# EAGLE schematic MCU_V2 (EAGLE 7.6.0)
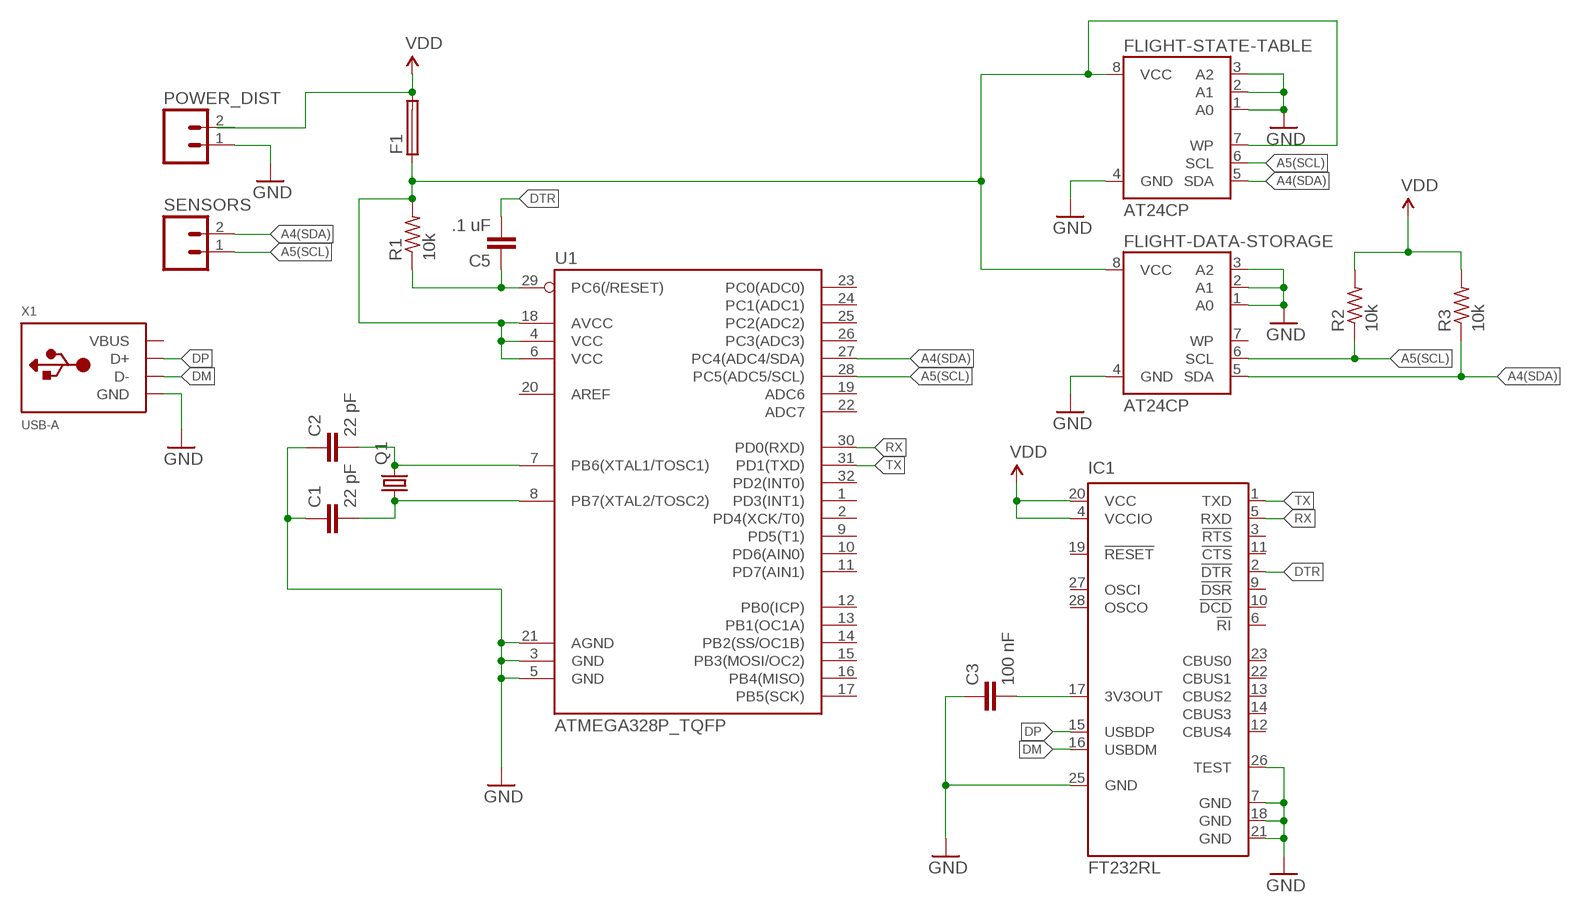
[diagram p0: schematic, sheet 1]

## Parts
C1  22 pF  C2,5-3  [C2.5-3]
C2  22 pF  C2,5-3  [C2.5-3]
C3  100 nF  C2,5-3  [C2.5-3]
C5  .1 uF  C2,5-3  [C2.5-3]
F1  19559  [19559]
FLIGHT-DATA-STORAGE  AT24CP  [DIL08]
FLIGHT-STATE-TABLE  AT24CP  [DIL08]
IC1  FT232RL  [SSOP28]
POWER_DIST  M02PTH  [1X02]
Q1  CRYSTALHC33U-V  [HC33U-V]
R1  10k  R-US_R0805  [R0805]
R2  10k  R-US_R0805  [R0805]
R3  10k  R-US_R0805  [R0805]
SENSORS  M02PTH  [1X02]
U1  ATMEGA328P_TQFP  [TQFP32-08]
X1  USB-A  [MOLEX_480371000]

## Nets
A4(SDA): FLIGHT-DATA-STORAGE.5(SDA) FLIGHT-STATE-TABLE.5(SDA) R3.1 SENSORS.2 U1.27(PC4(ADC4/SDA))
A5(SCL): FLIGHT-DATA-STORAGE.6(SCL) FLIGHT-STATE-TABLE.6(SCL) R2.1 SENSORS.1 U1.28(PC5(ADC5/SCL))
DM: IC1.16(USBDM) X1.2(D-)
DP: IC1.15(USBDP) X1.3(D+)
DTR: C5.2 IC1.2(!DTR)
GND: C1.1 C2.1 C3.1 FLIGHT-DATA-STORAGE.1(A0) FLIGHT-DATA-STORAGE.2(A1) FLIGHT-DATA-STORAGE.3(A2) FLIGHT-DATA-STORAGE.4(GND) FLIGHT-STATE-TABLE.1(A0) FLIGHT-STATE-TABLE.2(A1) FLIGHT-STATE-TABLE.3(A2) FLIGHT-STATE-TABLE.4(GND) IC1.7(GND) IC1.18(GND) IC1.21(GND) IC1.25(GND) IC1.26(TEST) POWER_DIST.1 U1.3(GND) U1.5(GND) U1.21(AGND) X1.4(GND)
N$1: C5.1 R1.1 U1.29(PC6(/RESET))
N$2: C2.2 Q1.2 U1.7(PB6(XTAL1/TOSC1))
N$3: C1.2 Q1.1 U1.8(PB7(XTAL2/TOSC2))
N$4: C3.2 IC1.17(3V3OUT)
N$9: F1.1 FLIGHT-DATA-STORAGE.8(VCC) FLIGHT-STATE-TABLE.7(WP) FLIGHT-STATE-TABLE.8(VCC) R1.2 U1.4(VCC) U1.6(VCC) U1.18(AVCC)
RX: IC1.5(RXD) U1.30(PD0(RXD))
TX: IC1.1(TXD) U1.31(PD1(TXD))
VDD: F1.2 IC1.4(VCCIO) IC1.20(VCC) R2.2 R3.2
Unconnected: FLIGHT-DATA-STORAGE.7(WP) IC1.3(!RTS) IC1.6(!RI) IC1.9(!DSR) IC1.10(!DCD) IC1.11(!CTS) IC1.12(CBUS4) IC1.13(CBUS2) IC1.14(CBUS3) IC1.19(!RESET) IC1.22(CBUS1) IC1.23(CBUS0) IC1.27(OSCI) IC1.28(OSCO) POWER_DIST.2 U1.1(PD3(INT1)) U1.2(PD4(XCK/T0)) U1.9(PD5(T1)) U1.10(PD6(AIN0)) U1.11(PD7(AIN1)) U1.12(PB0(ICP)) U1.13(PB1(OC1A)) U1.14(PB2(SS/OC1B)) U1.15(PB3(MOSI/OC2)) U1.16(PB4(MISO)) U1.17(PB5(SCK)) U1.19(ADC6) U1.20(AREF) U1.22(ADC7) U1.23(PC0(ADC0)) U1.24(PC1(ADC1)) U1.25(PC2(ADC2)) U1.26(PC3(ADC3)) U1.32(PD2(INT0))

## Power pins joined to a net without a drawn wire
VBUS: X1.1(VBUS)

## Library data of the parts
C1-C3 C5 = capacitor-wima:C: CAPACITOR naming: grid - package width
F1 = fuse:19559: FUSE HOLDER TR5, Wickmann; MPN: 55900000001; OC_FARNELL: 9516360; OC_NEWARK: 02P0286
FLIGHT-DATA-STORAGE FLIGHT-STATE-TABLE = atmel:AT24C*: 2-wire serial EEPROM; MPN: AT24C1024BW-SH-B; OC_FARNELL: 1362646; OC_NEWARK: 03P2044
IC1 = ftdichip:FT232R: Source: http://www.ftdichip.com/Documents/DataSheets/DS_FT232R_v104.pdf; MPN: FT232RL; OC_FARNELL: 1146032; OC_NEWARK: 91K9918
POWER_DIST SENSORS = SparkFun-Connectors:M02: Standard 2-pin 0.1" header. Use with - straight break away headers ( PRT-00116) - right angle break away headers (PRT-00553) - swiss pins (PRT-00743) - machine pins (PRT-00117) - female headers (PRT-00115) Molex polarized connector foot print use with: PRT-08233 with associated crimp pins and housings. 2.54_SCREWTERM for use with PRT-10571. 3.5mm Screw Terminal footprints for PRT-08084 5mm Screw Terminal footprints for use with PRT-08432
Q1 = adafruit:CRYSTAL: CRYSTAL; OC_FARNELL: unknown; OC_NEWARK: unknown
R1-R3 = resistor:R-US_: RESISTOR, American symbol
U1 = SparkFun-DigitalIC:ATMEGA328P_TQFP; PROD_ID: IC-09069
X1 = adafruit:USB-A: USB type A 'plug' Used for things that can directly connect to a USB port, say USB key